# Altium schematic sheet Audio.SchDoc
size A4
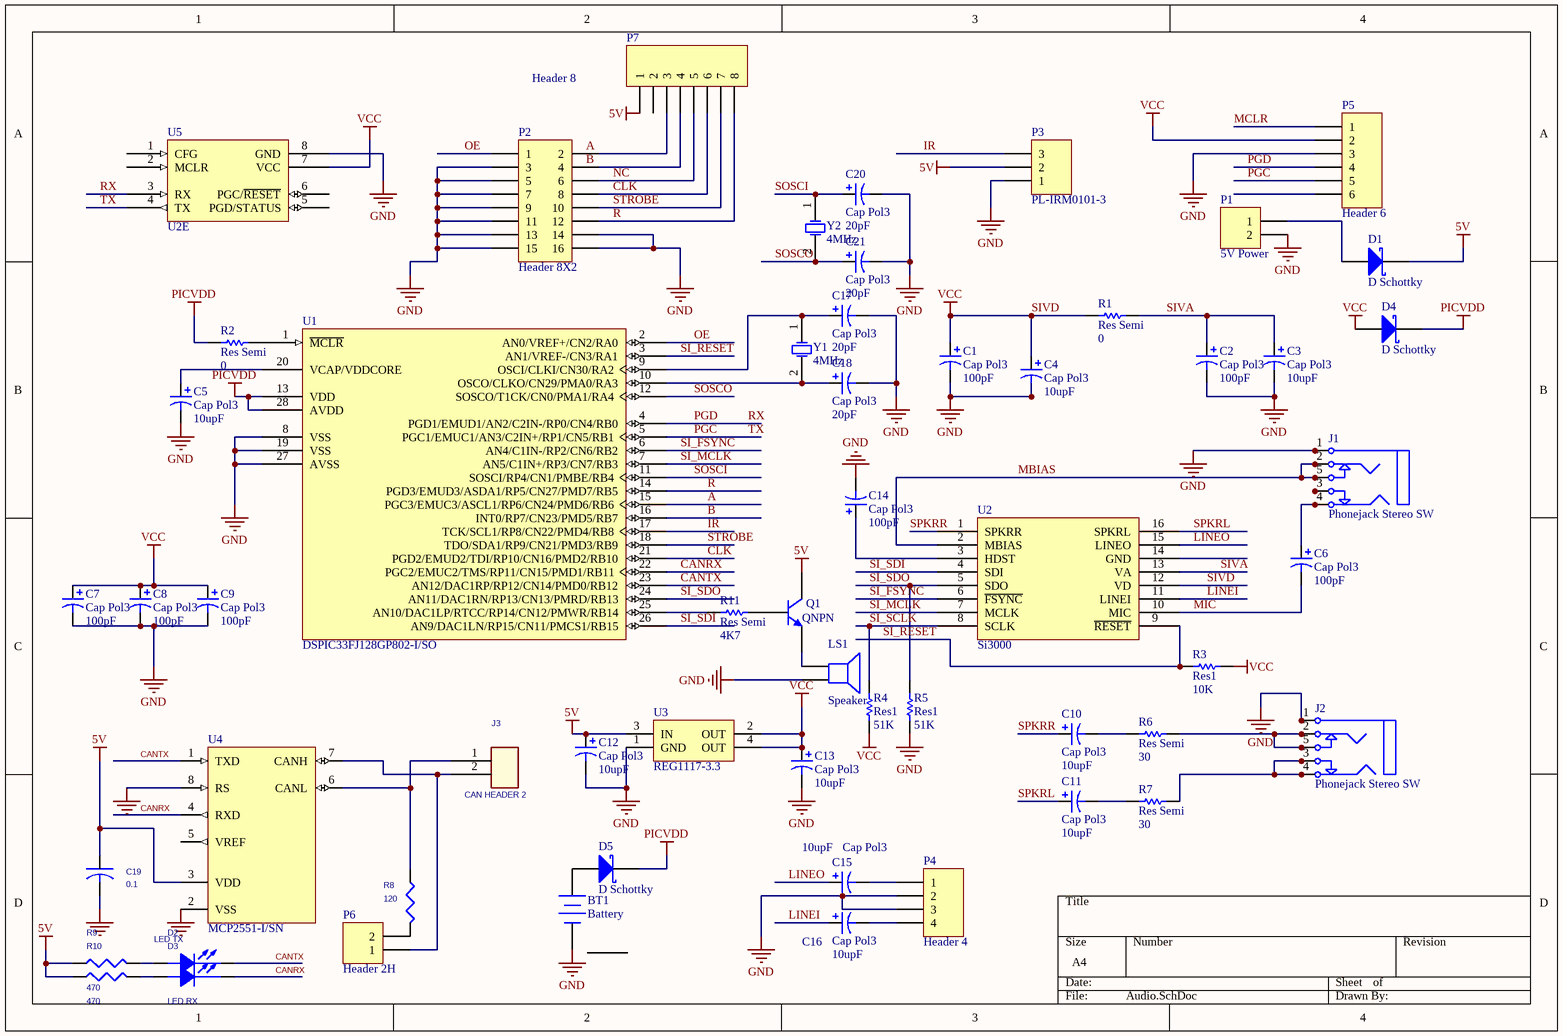
[diagram p0: Audio.SchDoc]

## Parts
BT1  Battery  [CR2032]
C1  Cap Pol3  value 100pF  [CAPC2012L]
C2  Cap Pol3  value 100pF  [CAPC3225M]
C3  Cap Pol3  value 10upF  [CAPC2012L]
C4  Cap Pol3  value 10upF  [CAPC3225M]
C5  Cap Pol3  value 10upF  [CAPC3225M]
C6  Cap Pol3  value 100pF  [CAPC2012L]
C7  Cap Pol3  value 100pF  [CAPC2012L]
C8  Cap Pol3  value 100pF  [CAPC2012L]
C9  Cap Pol3  value 100pF  [CAPC2012L]
C10  Cap Pol3  value 10upF  [CAPC3225M]
C11  Cap Pol3  value 10upF  [CAPC3225M]
C12  Cap Pol3  value 10upF  [CAPC3225M]
C13  Cap Pol3  value 10upF  [CAPC3225M]
C14  Cap Pol3  value 100pF  [CAPC2012L]
C15  Cap Pol3  value 10upF  [CAPC3225M]
C16  Cap Pol3  value 10upF  [CAPC3225M]
C17  Cap Pol3  value 20pF  [CAPC2012L]
C18  Cap Pol3  value 20pF  [CAPC2012L]
C19  0.1  [CAPC2012L]
C20  Cap Pol3  value 20pF  [CAPC2012L]
C21  Cap Pol3  value 20pF  [CAPC2012L]
D1  D Schottky  [DIO10.46-5.3x2.8]
D2  LED TX  [DSO-F2/D6.1]
D3  LED RX  [DSO-F2/D6.1]
D4  D Schottky  [DIO10.46-5.3x2.8]
D5  D Schottky  [DIO10.46-5.3x2.8]
J1  Phonejack Stereo SW  [AUDIO-JACK]
J2  Phonejack Stereo SW  [AUDIO-JACK]
J3  CAN HEADER 2  [DOMINO SMALL 2 PIN_REV2]
LS1  Speaker  [PIN2]
P1  5V Power  [DOMINO SMALL 2 PIN_REV2]
P2  Header 8X2  [HDR2X8]
P3  PL-IRM0101-3  [HDR1X3]
P4  Header 4  [HDR1X4]
P5  Header 6  [HDR1X6]
P6  Header 2H  [RESC2012M]
P7  Header 8  [HDR1X8]
Q1  QNPN  [SOT95P240-3M]
R1  Res Semi  value 0  [RESC2012L]
R2  Res Semi  value 0  [RESC2012L]
R3  Res1  value 10K  [RESC2012M]
R4  Res1  value 51K  [RESC2012M]
R5  Res1  value 51K  [RESC2012M]
R6  Res Semi  value 30  [RESC2012L]
R7  Res Semi  value 30  [RESC2012L]
R8  120  [RESC2012M]
R9  470  [RESC2012M]
R10  470  [RESC2012M]
R11  Res Semi  value 4K7  [RESC2012L]
U1  DSPIC33FJ128GP802-I/SO  [SOIC-SO28_N]
U2  Si3000  [SOIC127P1041-16M]
U3  REG1117-3.3  [ZZ311]
U4  MCP2551-I/SN  [SOIC-SN8_N]
U5  U2E  [U2E]
Y1  4MHz  [BCY-W2/E4.7]
Y2  4MHz  [BCY-W2/D2.1]

## Nets
5V: C12.1 C19.1 D1.2(K) P3.2 P7.1 Q1.3(C) R9.1 R10.1 U3.3(IN) U4.3(VDD)
GND: BT1.1(-) C1.2 C2.2 C3.2 C4.2 C5.2 C7.2 C8.2 C9.2 C12.2 C13.2 C14.2 C17.2 C18.2 C19.2 C20.2 C21.2 J1.1 J1.1A J1.1B J2.1 J2.1A J2.1B LS1.2 P1.2 P2.3 P2.5 P2.7 P2.9 P2.11 P2.13 P2.14 P2.15 P2.16 P3.1 P4.2 P4.3 P5.3 R5.1 U1.8(VSS) U1.19(VSS) U1.27(AVSS) U3.1(GND) U4.2(VSS) U4.8(RS) U5.8(GND)
PICVDD: D4.2(K) D5.2(K) R2.1 U1.13(VDD) U1.28(AVDD)
SIVD: C1.1 C4.1 C7.1 C8.1 C9.1 C13.1 D4.1(A) P5.2 R1.1 R3.1 R4.1 U2.12(VD) U3.2(OUT) U3.4(OUT) U5.7(VCC)  [also labelled VCC]
A: U1.15(PGC3/EMUC3/ASCL1/RP6/CN24/PMD6/RB6)
B: U1.16(INT0/RP7/CN23/PMD5/RB7)
CANRX: D3.2(CATHODE) U1.22(PGC2/EMUC2/TMS/RP11/CN15/PMD1/RB11) U4.4(RXD)
CANTX: D2.2(CATHODE) U1.23(AN12/DAC1RP/RP12/CN14/PMD0/RB12) U4.1(TXD)
CLK: P2.8 P7.6 U1.21(PGD2/EMUD2/TDI/RP10/CN16/PMD2/RB10)
IR: P3.3 U1.17(TCK/SCL1/RP8/CN22/PMD4/RB8)
LINEI: C16.1 U2.11(LINEI)
LINEO: C15.1 U2.15(LINEO)
MBIAS: J1.2 J1.2A J1.2B J1.5 J1.5A J1.5B U2.2(MBIAS)
MCLR: P5.1
MIC: C6.2 U2.10(MIC)
NC: P2.6 P7.5
OE: P2.1 U1.2(AN0/VREF+/CN2/RA0)
PGC: P5.5 U1.5(PGC1/EMUC1/AN3/C2IN+/RP1/CN5/RB1) U5.4(TX)  [also labelled TX]
PGD: P5.4 U1.4(PGD1/EMUD1/AN2/C2IN-/RP0/CN4/RB0) U5.3(RX)  [also labelled RX]
R: P2.12 P7.8 U1.14(PGD3/EMUD3/ASDA1/RP5/CN27/PMD7/RB5)
SI_FSYNC: U1.6(AN4/C1IN-/RP2/CN6/RB2) U2.6(~{FSYNC})
SI_MCLK: U1.7(AN5/C1IN+/RP3/CN7/RB3) U2.7(MCLK)
SI_RESET: R3.2 U1.3(AN1/VREF-/CN3/RA1) U2.9(~{RESET})
SI_SCLK: R4.2 U2.8(SCLK)
SI_SDI: U1.26(AN9/DAC1LN/RP15/CN11/PMCS1/RB15) U2.4(SDI)
SI_SDO: R5.2 U1.24(AN11/DAC1RN/RP13/CN13/PMRD/RB13) U2.5(SDO)
SIVA: C2.1 C3.1 R1.2 U2.13(VA)
SOSCI: C20.1 U1.11(SOSCI/RP4/CN1/PMBE/RB4) Y2.1(OSC1)
SOSCO: C21.1 U1.12(SOSCO/T1CK/CN0/PMA1/RA4) Y2.2(OSC2)
SPKRL: C11.1 U2.16(SPKRL)
SPKRR: C10.1 U2.1(SPKRR)
STROBE: P2.10 P7.7 U1.18(TDO/SDA1/RP9/CN21/PMD3/RB9)
NetBT1_2: BT1.2(+) D5.1(A)
NetC5_1: C5.1 U1.20(VCAP/VDDCORE)
NetC6_1: C6.1 J1.4 J1.4A J1.4B
NetC10_2: C10.2 R6.1
NetC11_2: C11.2 R7.1
NetC14_1: C14.1 U2.3(HDST)
NetC15_2: C15.2 P4.1
NetC16_2: C16.2 P4.4
NetC17_1: C17.1 U1.9(OSCI/CLKI/CN30/RA2) Y1.1(OSC1)
NetC18_1: C18.1 U1.10(OSCO/CLKO/CN29/PMA0/RA3) Y1.2(OSC2)
NetD1_1: D1.1(A) P1.1
NetD2_1: D2.1(ANODE) R9.2
NetD3_1: D3.1(ANODE) R10.2
NetJ1_3: J1.3 J1.3A J1.3B
NetJ2_2: J2.2 J2.2A J2.2B J2.5 J2.5A J2.5B R6.2
NetJ2_3: J2.3 J2.3A J2.3B J2.4 J2.4A J2.4B R7.2
NetJ3_1: J3.1 R8.1 U4.6(CANL)
NetJ3_2: J3.2 P6.1 U4.7(CANH)
NetLS1_1: LS1.1 Q1.2(E)
NetP2_2: P2.2 P7.3
NetP2_4: P2.4 P7.4
NetP6_2: P6.2 R8.2
NetQ1_1: Q1.1(B) R11.2
NetR2_2: R2.2 U1.1(~{MCLR})
NetR11_1: R11.1 U1.25(AN10/DAC1LP/RTCC/RP14/CN12/PMWR/RB14)

Not connected (* = marked no-connect by the designer): BT1 3(+); P5 6; P7 2; U2 14(GND); U4 5(VREF); U5 1(CFG) 2(MCLR) 5(PGD/STATUS) 6(PGC/~{RESET})

## Notes on the sheet
- Labels drawn without touching a wire or pin: A, B

## Library data of the parts
BT1 = Battery: Multicell Battery; Published: 24-Mar-1999; LatestRevisionDate: 17-Jul-2002; LatestRevisionNote: Re-released for DXP Platform.; PackageReference: BAT-2; Publisher: Altium Limited
C1-C18 C20 C21 = Cap Pol3: Polarized Capacitor (Surface Mount); Published: 8-Jun-2000; PackageReference: C0805; Publisher: Altium Limited
  C1-C16: LatestRevisionDate: 29-May-2009; LatestRevisionNote: IPC-7351 Footprint Added.; PackageDescription: Chip Capacitor
  C17 C18 C20 C21: LatestRevisionDate: 17-Jul-2002; LatestRevisionNote: Re-released for DXP Platform.
C19 = C_Dup1
D1 D4 D5 = D Schottky: Schottky Diode; Published: 8-Jun-2000; LatestRevisionDate: 17-Jul-2002; LatestRevisionNote: Re-released for DXP Platform.; PackageReference: SMB; Publisher: Altium Limited; Code_JEDEC: DO-214-AA
D2 D3 = LED
J1 J2 = Phonejack Stereo SW: 3-Conductor Jack with 2 break contacts (normals) and 2 auxiliary make contacts; Published: 5-Jan-2004; LatestRevisionDate: 17-Dec-2003; LatestRevisionNote: PCB Footprint replaced.; DatasheetDocument: 07-Mar-2000; Publisher: Altium Limited; ComponentLink1Description: Manufacturer Link; ComponentLink1URL: http://domino.kycon.com/internet/Products.html
J3 = CON2
LS1 = Speaker: Loudspeaker; Published: 24-Mar-1999; LatestRevisionDate: 17-Jul-2002; LatestRevisionNote: Re-released for DXP Platform.; PackageReference: PIN2; Publisher: Altium Limited
P1 = Header 2: Header, 2-Pin; LatestRevisionDate: 17-Jul-2002; LatestRevisionNote: Re-released for DXP Platform.; Publisher: Altium Limited
P2 = Header 8X2: Header, 8-Pin, Dual row; LatestRevisionDate: 17-Jul-2002; LatestRevisionNote: Re-released for DXP Platform.; Publisher: Altium Limited
P3 = Header 3: Header, 3-Pin; LatestRevisionDate: 17-Jul-2002; LatestRevisionNote: Re-released for DXP Platform.; Publisher: Altium Limited
P4 = Header 4: Header, 4-Pin; LatestRevisionDate: 17-Jul-2002; LatestRevisionNote: Re-released for DXP Platform.; Publisher: Altium Limited
P5 = Header 6: Header, 6-Pin; LatestRevisionDate: 17-Jul-2002; LatestRevisionNote: Re-released for DXP Platform.; Publisher: Altium Limited
P6 = Header 2H: Header, 2-Pin, Right Angle; LatestRevisionDate: 17-Jul-2002; LatestRevisionNote: Re-released for DXP Platform.; Publisher: Altium Limited
P7 = Header 8: Header, 8-Pin; LatestRevisionDate: 17-Jul-2002; LatestRevisionNote: Re-released for DXP Platform.; Publisher: Altium Limited
Q1 = QNPN: NPN Bipolar Transistor; Published: 8-Jun-2000; LatestRevisionDate: 29-May-2009; LatestRevisionNote: IPC-7351 Footprint Added.; PackageVersion: Aug-1999; PackageReference: SOT-23B; Publisher: Altium Limited; PackageDescription: 3-Pin SOT-23 Package 0.95 mm Pitch, 2.4 mm Lead Span
R1 R2 R6 R7 R11 = Res Semi: Semiconductor Resistor; Published: 8-Jun-2000; LatestRevisionDate: 17-Jul-2002; LatestRevisionNote: Re-released for DXP Platform.; PackageReference: AXIAL-0.5; Publisher: Altium Limited
R3-R5 = Res1: Resistor; Published: 8-Jun-2000; LatestRevisionDate: 17-Jul-2002; LatestRevisionNote: Re-released for DXP Platform.; PackageReference: AXIAL-0.3; Publisher: Altium Limited
R8-R10 = R_Dup1
U1 = DSPIC33FJ128GP802-I/SO: High-Performance 16-bit Digital Signal Controller, 128 KB Flash, 16 KB RAM, 28-Pin SOIC, Industrial Temperature; Published: 29-Jan-2009; DatasheetVersion: revB, Mar-2008; PackageVersion: revAW, Oct-2008; PackageReference: SOIC-SO28; Publisher: Altium Limited; PackageDescription: 28-Lead Plastic Small Outline (SO) - Wide 7.50mm Body [SOIC]; Code_JEDEC: MS-013; ComponentLink1Description: Manufacturer Link; ComponentLink1URL: http://www.microchip.com; ComponentLink2Description: Datasheet; ComponentLink2URL: http://ww1.microchip.com/downloads/en/DeviceDoc/70292B.pdf; ComponentLink3Description: Packaging Specification; ComponentLink3URL: http://ww1.microchip.com/downloads/en/PackagingSpec/00049AW.pdf
U3 = REG1117-3.3: 800mA and 1A Low Dropout Positive Regulator 2.85V, 3.3V, 5V, and Adjustable; Published: 8-Jun-2000; LatestRevisionDate: 17-Jul-2002; LatestRevisionNote: Re-released for DXP Platform.; DatasheetVersion: Sep-1997; PackageVersion: revC; PackageReference: ZZ311; Publisher: Altium Limited; PackageDescription: SOT-223/SC-73; 4 Leads; Body 6.7 x 7.3 mm, inc. leads (LxW max); ComponentLink1Description: Manufacturer Link; ComponentLink1URL: http://www.ti.com/; ComponentLink2Description: Datasheet; ComponentLink2URL: http://www-s.ti.com/sc/ds/REG1117.pdf
U4 = MCP2551-I/SN: High-Speed CAN Transceiver, 8-Pin SOIC, Industrial Temperature; Published: 29-Jan-2009; DatasheetVersion: revE, Jan-2007; PackageVersion: revAW, Oct-2008; PackageReference: SOIC-SN8; Publisher: Altium Limited; PackageDescription: 8-Lead Plastic Small Outline (SN) - Narrow, 3.90mm Body [SOIC]; Code_JEDEC: MS-012; Code_IPC: SOIC127P600-8; ComponentLink1Description: Manufacturer Link; ComponentLink1URL: http://www.microchip.com; ComponentLink2Description: Datasheet; ComponentLink2URL: http://ww1.microchip.com/downloads/en/DeviceDoc/21667E.pdf; ComponentLink3Description: Packaging Specification; ComponentLink3URL: http://ww1.microchip.com/downloads/en/PackagingSpec/00049AW.pdf
Y1 Y2 = XTAL: Crystal Oscillator; Published: 8-Jun-2000; LatestRevisionDate: 17-Jul-2002; LatestRevisionNote: Re-released for DXP Platform.; PackageReference: R38; Publisher: Altium Limited